# EAGLE design n7byu_k3ng_rotator_shield (EAGLE 6.6.0)
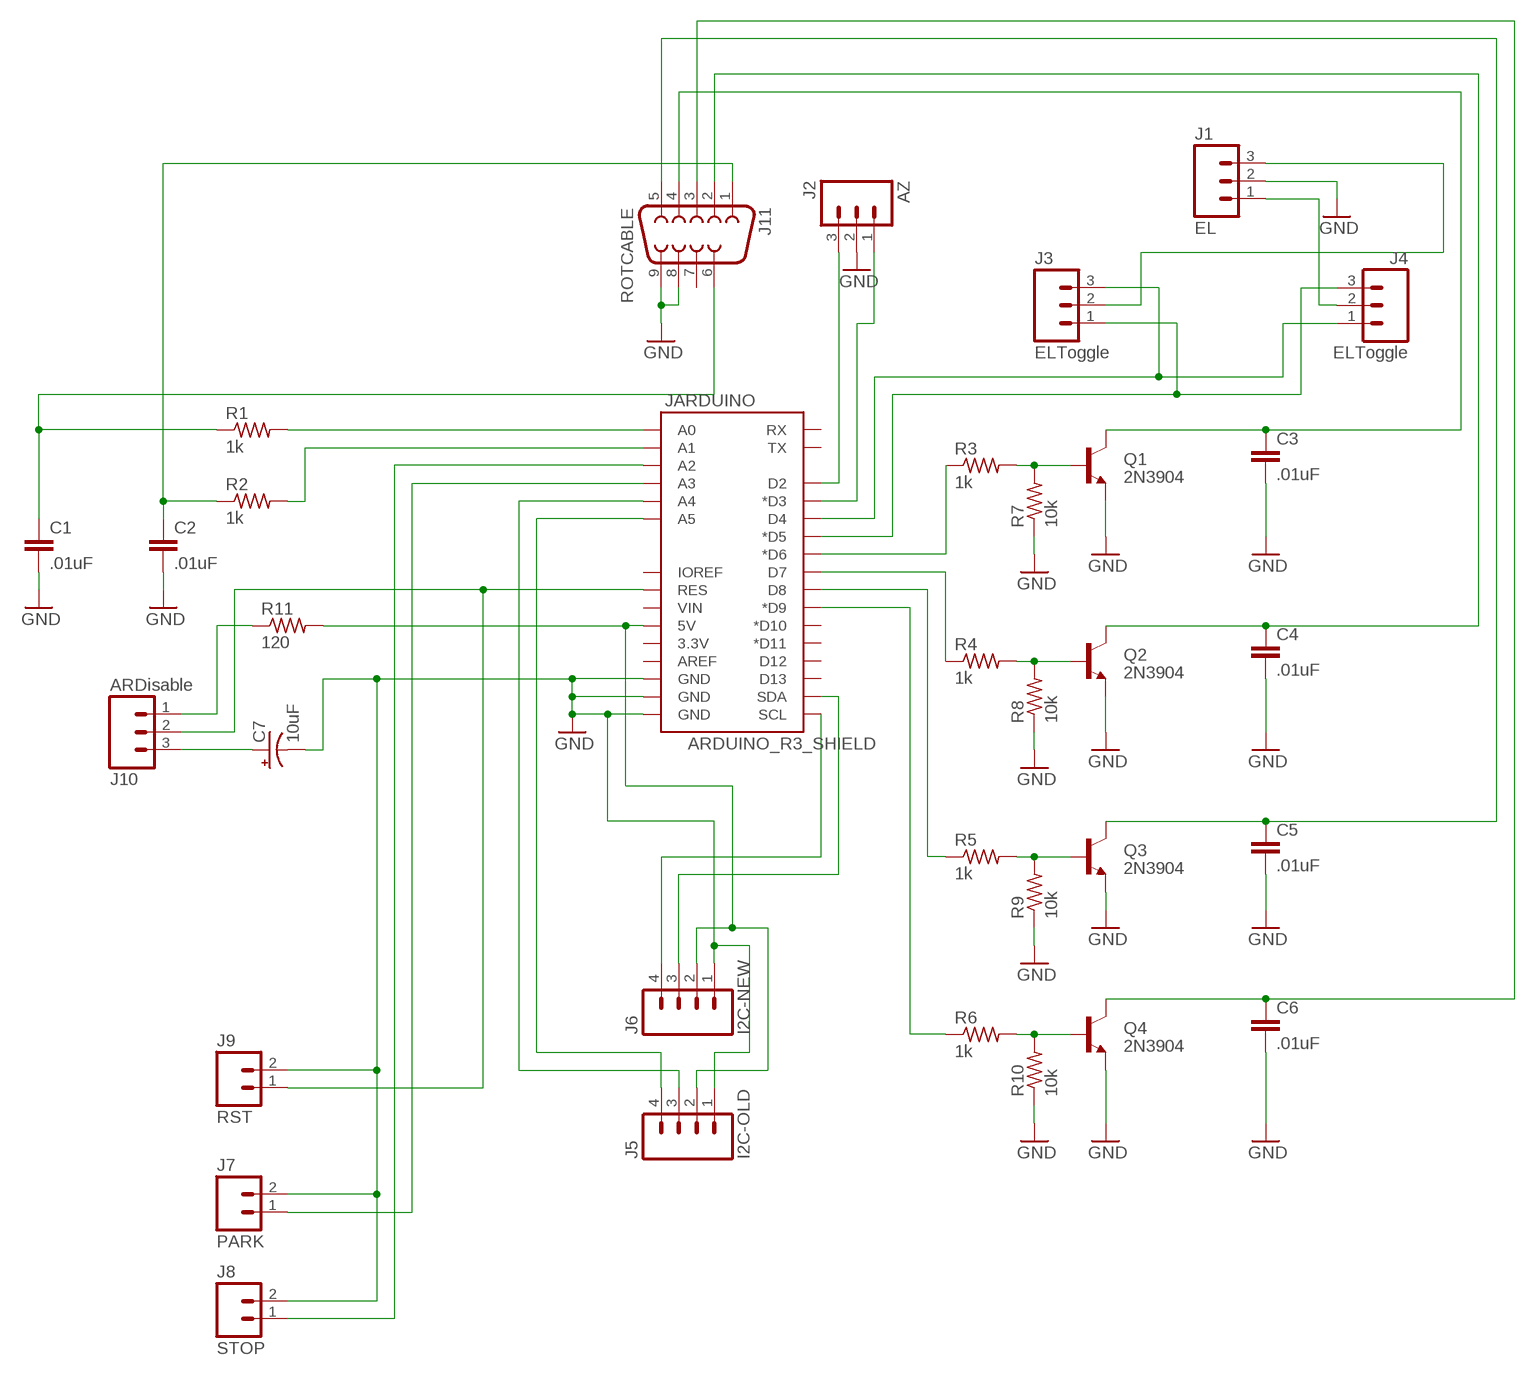
[diagram p0: schematic, sheet 1]

## Parts
C1  .01uF  CAPEZ  [CAP-PTH-SMALLEZ]
C2  .01uF  CAPEZ  [CAP-PTH-SMALLEZ]
C3  .01uF  CAPEZ  [CAP-PTH-SMALLEZ]
C4  .01uF  CAPEZ  [CAP-PTH-SMALLEZ]
C5  .01uF  CAPEZ  [CAP-PTH-SMALLEZ]
C6  .01uF  CAPEZ  [CAP-PTH-SMALLEZ]
C7  10uF  CAP_POLPTH1  [CPOL-RADIAL-100UF-25V]
J1  EL  M03LOCK_LONGPADS  [1X03_LOCK_LONGPADS]
J2  AZ  M03LOCK_LONGPADS  [1X03_LOCK_LONGPADS]
J3  ELToggle  M03LOCK_LONGPADS  [1X03_LOCK_LONGPADS]
J4  ELToggle  M03LOCK_LONGPADS  [1X03_LOCK_LONGPADS]
J5  I2C-OLD  M04LOCK_LONGPADS  [1X04_LOCK_LONGPADS]
J6  I2C-NEW  M04LOCK_LONGPADS  [1X04_LOCK_LONGPADS]
J7  PARK  M02LOCK_LONGPADS  [1X02_LOCK_LONGPADS]
J8  STOP  M02LOCK_LONGPADS  [1X02_LOCK_LONGPADS]
J9  RST  M02LOCK_LONGPADS  [1X02_LOCK_LONGPADS]
J10  ARDisable  M03LOCK_LONGPADS  [1X03_LOCK_LONGPADS]
J11  ROTCABLE  DB9FEMALE  [DB9]
JARDUINO  ARDUINO_R3_SHIELD  [UNO_R3_SHIELD]
Q1  2N3904  TRANSISTOR_NPN2N3904-EZ  [TO-92-EZ]
Q2  2N3904  TRANSISTOR_NPN2N3904-EZ  [TO-92-EZ]
Q3  2N3904  TRANSISTOR_NPN2N3904-EZ  [TO-92-EZ]
Q4  2N3904  TRANSISTOR_NPN2N3904-EZ  [TO-92-EZ]
R1  1k  R-US_0204/7  [0204/7]
R2  1k  R-US_0204/7  [0204/7]
R3  1k  R-US_0204/7  [0204/7]
R4  1k  R-US_0204/7  [0204/7]
R5  1k  R-US_0204/7  [0204/7]
R6  1k  R-US_0204/7  [0204/7]
R7  10k  R-US_0204/7  [0204/7]
R8  10k  R-US_0204/7  [0204/7]
R9  10k  R-US_0204/7  [0204/7]
R10  10k  R-US_0204/7  [0204/7]
R11  120  R-US_0204/7  [0204/7]

## Nets
CCW-BUTTON: J2.1 JARDUINO.D3(*D3)
CW-BUTTON: J2.3 JARDUINO.D2
GND: C1.2 C2.2 C3.2 C4.2 C5.2 C6.2 C7.2(-) J1.2 J2.2 J5.1 J6.1 J7.2 J8.2 J9.2 J11.8 J11.9 JARDUINO.GND@0(GND) JARDUINO.GND@1(GND) JARDUINO.GND@2(GND) Q1.1(E) Q2.1(E) Q3.1(E) Q4.1(E) R7.1 R8.1 R9.1 R10.1
N$1: C1.1 J11.6 R1.1
N$2: Q1.2(B) R3.2 R7.2
N$3: Q2.2(B) R4.2 R8.2
N$4: JARDUINO.A0 R1.2
N$5: C2.1 J11.1 R2.1
N$6: JARDUINO.A1 R2.2
N$7: Q3.2(B) R5.2 R9.2
N$8: Q4.2(B) R6.2 R10.2
N$9: C3.1 J11.4 Q1.3(C)
N$10: C4.1 J11.2 Q2.3(C)
N$11: C7.1(+) J10.3
N$12: C6.1 J11.3 Q4.3(C)
N$13: J9.1 J10.2 JARDUINO.RES
N$14: J1.1 J4.2
N$15: JARDUINO.D6(*D6) R3.1
N$16: JARDUINO.D7 R4.1
N$17: JARDUINO.D8 R5.1
N$18: C5.1 J11.5 Q3.3(C)
N$19: JARDUINO.D9(*D9) R6.1
N$20: J10.1 R11.1
N$21: J1.3 J3.2
N$22: J8.1 JARDUINO.A2
N$23: J3.3 J4.1 JARDUINO.D4
N$24: J3.1 J4.3 JARDUINO.D5(*D5)
N$25: J5.4 JARDUINO.A5
N$26: J5.2 J6.2 JARDUINO.5V R11.2
N$27: J5.3 JARDUINO.A4
N$28: J7.1 JARDUINO.A3
N$29: J6.3 JARDUINO.SDA
N$32: J6.4 JARDUINO.SCL
Unconnected: J11.7 JARDUINO.3.3V JARDUINO.AREF JARDUINO.D10(*D10) JARDUINO.D11(*D11) JARDUINO.D12 JARDUINO.D13 JARDUINO.IOREF JARDUINO.RX JARDUINO.TX JARDUINO.VIN

## Library data of the parts
C1-C6 = SparkFun-Capacitors:CAP: Capacitor Standard 0603 ceramic capacitor, and 0.1" leaded capacitor.
C7 = SparkFun-Capacitors:CAP_POL: Capacitor Polarized These are standard SMD and PTH capacitors. Normally 10uF, 47uF, and 100uF in electrolytic and tantalum varieties. Always verify the external diameter of the through hole cap, it varies with capacity, voltage, and manufacturer. The EIA devices should be standard.
J1-J4 J10 = SparkFun-Connectors:M03: Header 3 Standard 3-pin 0.1" header. Use with straight break away headers (SKU : PRT-00116), right angle break away headers (PRT-00553), swiss pins (PRT-00743), machine pins (PRT-00117), and female headers (PRT-00115). Molex polarized connector foot print use with SKU : PRT-08232 with associated crimp pins and housings.
J5 J6 = SparkFun-Connectors:M04: Header 4 Standard 4-pin 0.1" header. Use with straight break away headers (SKU : PRT-00116), right angle break away headers (PRT-00553), swiss pins (PRT-00743), machine pins (PRT-00117), and female headers (PRT-00115). Molex polarized connector foot print use with SKU : PRT-08231 with associated crimp pins and housings. 1MM SMD Version SKU: PRT-10208; PROD_ID: CONN-09696
J7-J9 = SparkFun-Connectors:M02: Standard 2-pin 0.1" header. Use with - straight break away headers ( PRT-00116) - right angle break away headers (PRT-00553) - swiss pins (PRT-00743) - machine pins (PRT-00117) - female headers (PRT-00115) Molex polarized connector foot print use with: PRT-08233 with associated crimp pins and housings. 2.54_SCREWTERM for use with PRT-10571. 3.5mm Screw Terminal footprints for PRT-08084 5mm Screw Terminal footprints for use with PRT-08432
J11 = SparkFun-Connectors:DB9: DB9 Connector Standard DB9 (D-Sub 9) serial connector. Can be used for CAN bus as well as RS485 and RS232. Footprint production proven. Spark Fun Electronics SKU : PRT-00429; PROD_ID: CONN-08194
JARDUINO = SparkFun-Boards:ARDUINO_R3_SHIELD: Shield form compatible with the Arduino Uno R3.
Q1-Q4 = SparkFun-DiscreteSemi:TRANSISTOR_NPN: Generic NPN BJT MMBT2222A - TRANS-08049 (SOT-23, 1A 40V) MPSA42 - TRANS-09116 (SOT-23, 500mA 300V) MMBT5088LT1G - TRANS-11160 (SOT-23, 50 mA 30V) BC547 - COM-08928 <http://www.sparkfun.com/products/8928> (TO-92 45V 100mA) (1.Collector 2.Base 3.Emitter) 2N3904 - COM-00521 <http://www.sparkfun.com/products/521> (TO-92 40V 200mA) (1.Emitter 2.Base 3.Collector) P2N2222A - COM-12852 <http://www.sparkfun.com/products/12852> (TO-92 40V 600mA) (1.Collector 2.Base 3.Emitter); PROD_ID: TRANS-08447
R1-R11 = resistor:R-US_: RESISTOR, American symbol

## Net classes
0 default: width 0.254 mm, clearance 0.254 mm

## Board
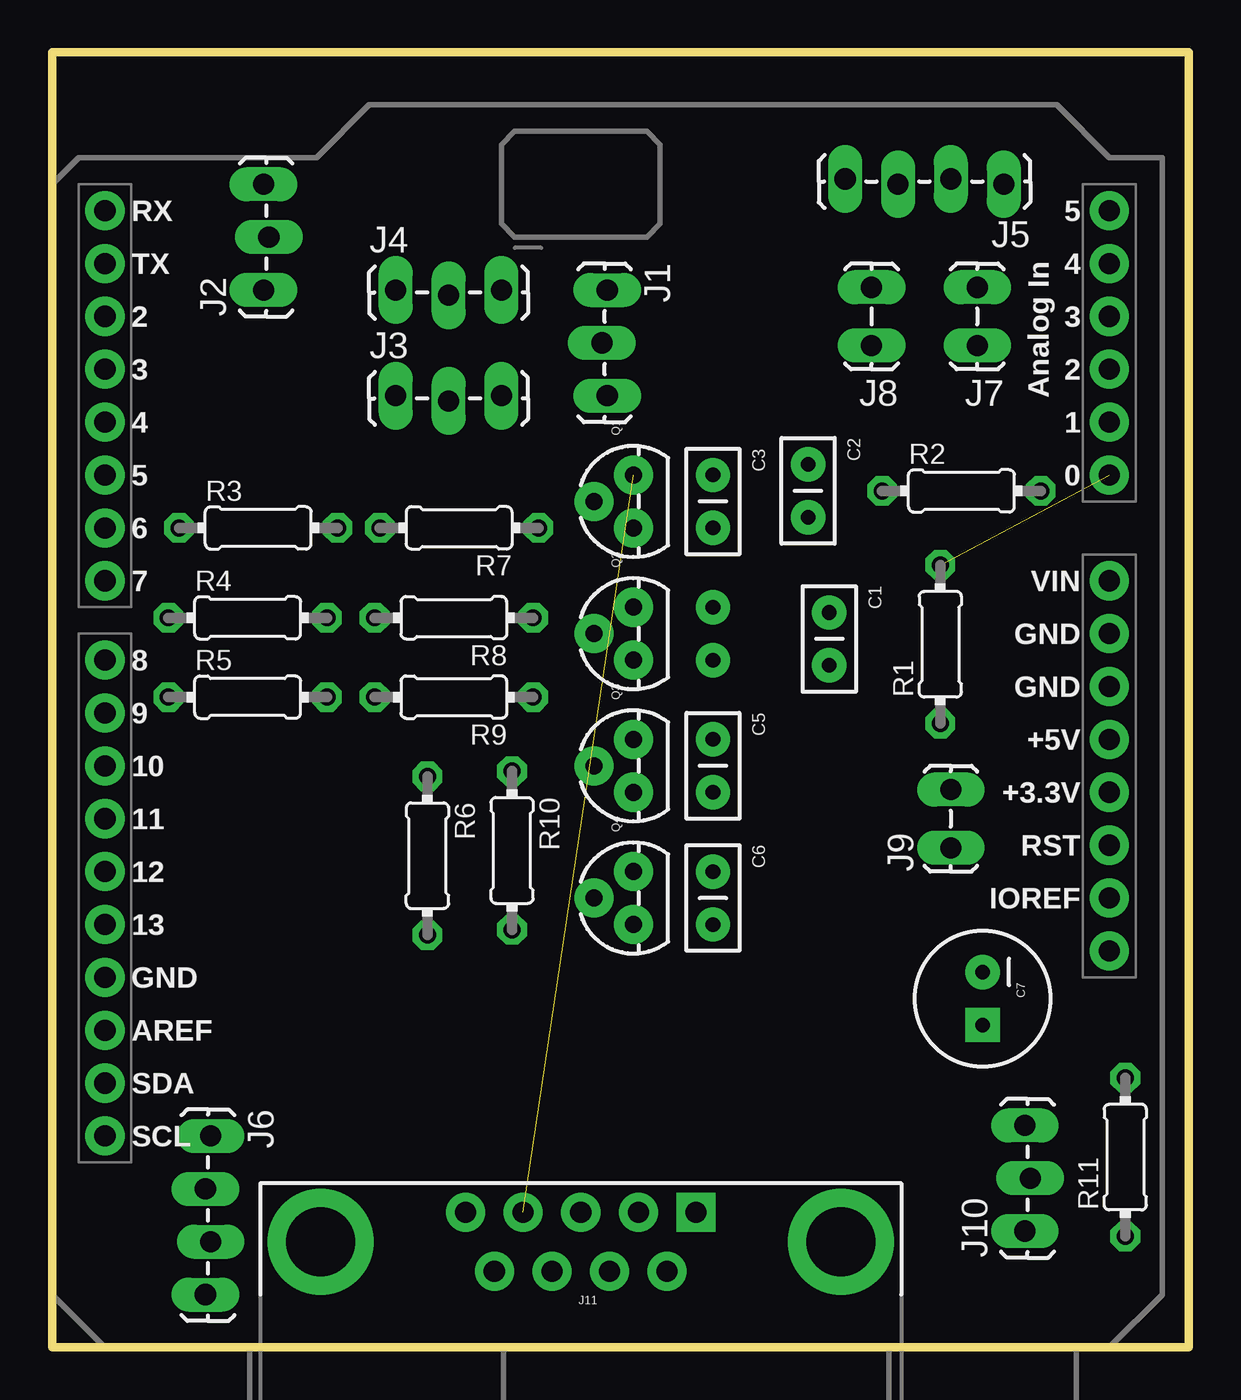
[diagram p1: board, top side]
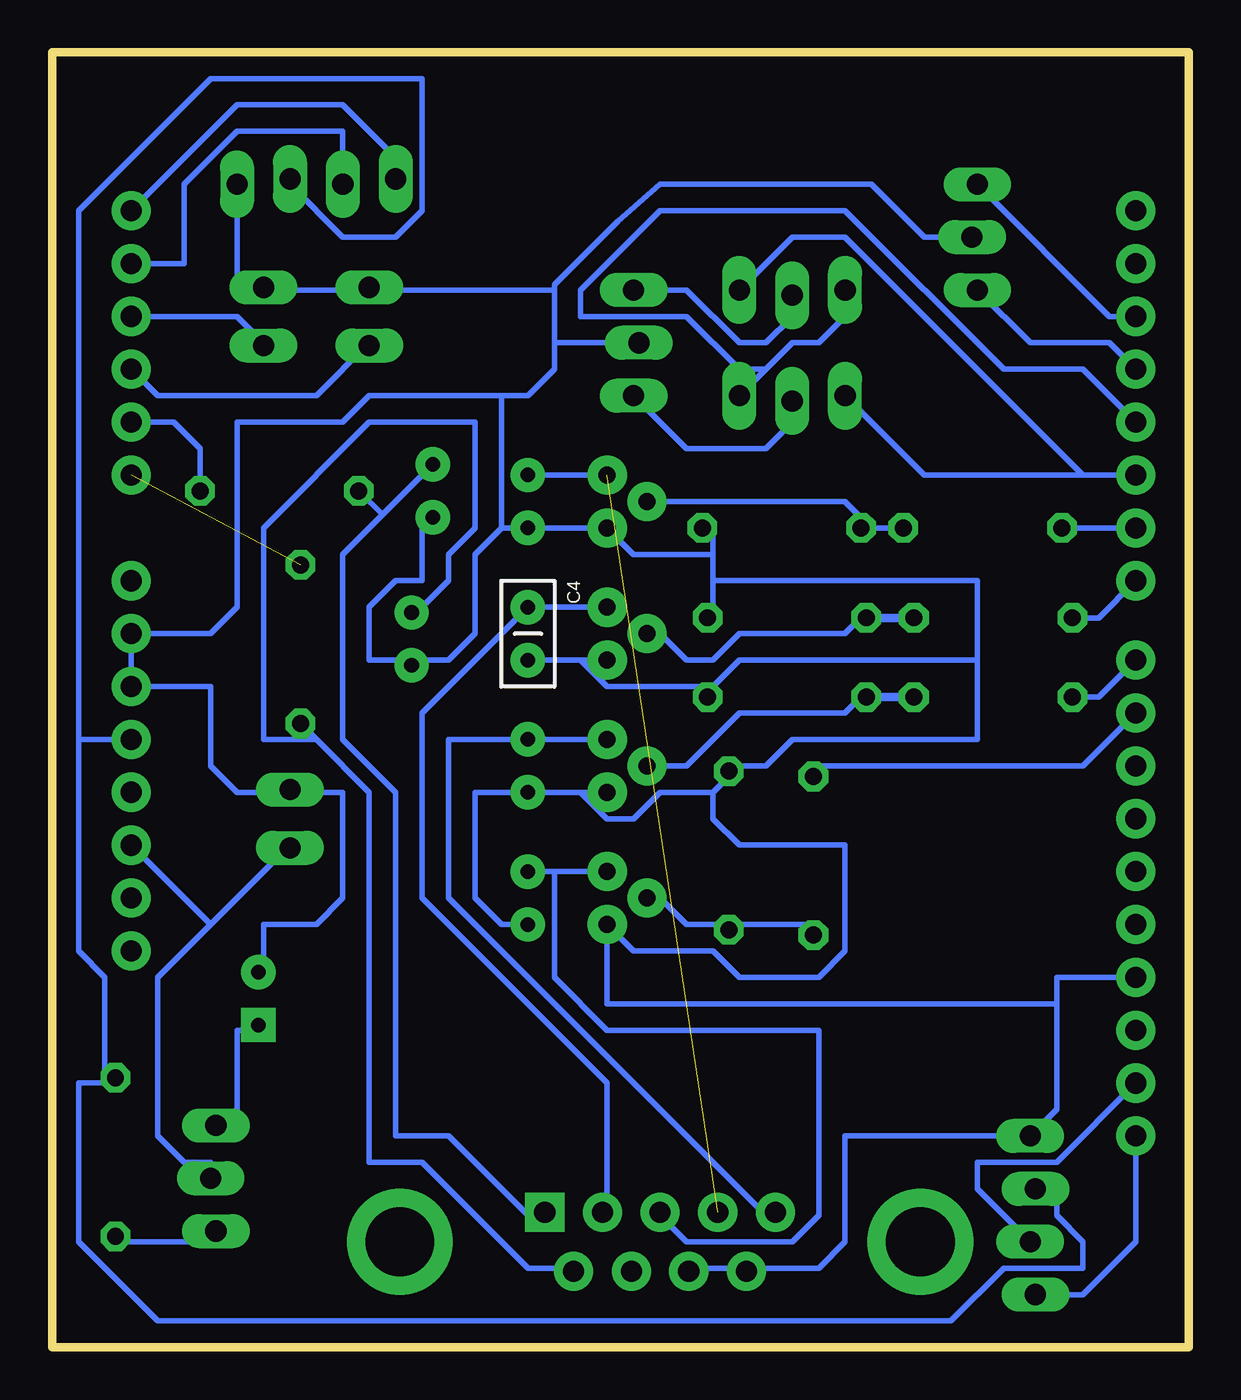
[diagram p2: board, bottom side, seen from below]

Size 54.61 x 62.23 mm. Coordinates in mm from the lower left corner, seen from the top.
Outline: 0,62.23 54.61,62.23 54.61,0 0,0 0,62.23
Copper layers (1*16): Top 0.035mm / dielectric 1.5mm / Bottom 0.035mm
Design rules "SparkFun": minimum track width 8mil, minimum drill 20mil, track to track 8mil, track to pad 8mil, pad to pad 8mil, via to via 8mil, smd to smd 8mil, copper to edge 10mil, drill to drill 8mil, minimum pad ring 12mil, minimum via ring 10mil, stop-mask expansion 4mil, vias tented up to drill 25mil, thermal gap 10mil

### Footprints (pad centres in the part's own frame; a part is rotated, then mirrored left to right if it is on the bottom)
CAP-PTH-SMALLEZ = drill 0.7 pad 1.651: 1 0,0; 2 2.54,0
CPOL-RADIAL-100UF-25V = drill 0.7 pad 1.651 square: 1 1.27,0 | drill 0.7 pad 1.651: 2 -1.27,0
1X03_LOCK_LONGPADS = drill 1.016 long: 1 0,0; 2 2.54,-0.254; 3 5.08,0
1X04_LOCK_LONGPADS = drill 1.016 long: 1 0,0; 2 2.54,-0.254; 3 5.08,0; 4 7.62,-0.254
1X02_LOCK_LONGPADS = drill 1.016 long: 1 -0.127,0; 2 2.667,0
DB9 = drill 1.016 pad 1.88 square: 1 -5.54,-1.42 | drill 1.016 pad 1.88: 2 -2.77,-1.42; 3 0,-1.42; 4 2.77,-1.42; 5 5.54,-1.42; 6 -4.15,1.42; 7 -1.38,1.42; 8 1.38,1.42; 9 4.15,1.42 | drill 3.302 pad 5.08: G1 -12.5,0; G2 12.5,0
UNO_R3_SHIELD = drill 1.016 pad 1.88: 3.3V 50.8,26.67; 5V 50.8,29.21; A0 50.8,41.91; A1 50.8,44.45; A2 50.8,46.99; A3 50.8,49.53; A4 50.8,52.07; A5 50.8,54.61; AREF 2.54,15.24; D2 2.54,49.53; D3 2.54,46.99; D4 2.54,44.45; D5 2.54,41.91; D6 2.54,39.37; D7 2.54,36.83; D8 2.54,33.02; D9 2.54,30.48; D10 2.54,27.94; D11 2.54,25.4; D12 2.54,22.86; D13 2.54,20.32; GND@0 50.8,31.75; GND@1 50.8,34.29; GND@2 2.54,17.78; IOREF 50.8,21.59; NC 50.8,19.05; RES 50.8,24.13; RX 2.54,54.61; SCL 2.54,10.16; SDA 2.54,12.7; TX 2.54,52.07; VIN 50.8,36.83
TO-92-EZ = drill 0.813 pad 1.88: 1 -1.27,0; 2 0,1.905; 3 1.27,0
0204/7 = drill 0.813 octagon: 1 -3.81,0; 2 3.81,0

### Placement (x,y rotation side)
C1  37.34,35.31 270 top
C2  36.32,42.42 270 top
C3  31.75,41.91 270 top
C4  31.75,35.56 270 bottom
C5  31.75,29.21 270 top
C6  31.75,22.86 270 top
C7  44.7,16.76 270 top
J1  26.67,50.8 270 top
J2  10.16,50.8 90 top
J3  16.51,45.72 0 top
J4  16.51,50.8 0 top
J5  45.72,55.88 180 top
J6  7.62,10.16 270 top
J7  44.45,48.26 90 top
J8  39.37,48.26 90 top
J9  43.18,24.13 90 top
J10  46.74,5.59 90 top
J11  25.4,5.08 180 top
JARDUINO  0,0 0 top
Q1  27.94,40.64 90 top
Q2  27.94,34.29 90 top
Q3  27.94,27.94 90 top
Q4  27.94,21.59 90 top
R1  42.67,33.78 90 top
R2  43.69,41.15 0 top
R3  9.91,39.37 0 top
R4  9.4,35.05 0 top
R5  9.4,31.24 0 top
R6  18.03,23.62 270 top
R7  19.56,39.37 180 top
R8  19.3,35.05 180 top
R9  19.3,31.24 180 top
R10  22.1,23.88 270 top
R11  51.56,9.14 90 top

### Tracks (layer width: path | path; a pad name or v marks a point on that pad's centre or on a via)
CCW-BUTTON
  Bottom 0.254: J2.1 7.62,48.26 3.81,48.26 JARDUINO.D3
CW-BUTTON
  Bottom 0.254: J2.3 3.81,49.53 JARDUINO.D2
GND
  Bottom 0.254: J11.8 24.13,3.81 21.59,3.81 J11.9 20.32,3.81 17.78,3.81 16.51,5.08 16.51,10.16 J6.1 6.35,11.43 6.35,16.51 | 6.35,16.51 6.35,17.78 JARDUINO.GND@2 | 6.35,16.51 27.94,16.51 Q4.1 26.67,19.05 22.86,19.05 21.59,17.78 17.78,17.78 16.51,19.05 16.51,24.13 21.59,24.13 22.86,25.4 22.86,26.67 | 22.86,26.67 21.59,27.94 | 22.86,26.67 25.4,26.67 26.67,25.4 27.94,25.4 29.21,26.67 | 29.21,26.67 C5.2 34.29,26.67 34.29,21.59 33.02,20.32 C6.2 | 29.21,26.67 Q3.1 | 22.86,31.75 27.94,31.75 29.21,33.02 | C4.2 29.21,33.02 | 29.21,33.02 Q2.1 | 22.86,38.1 22.86,39.37 R7.1 | 22.86,38.1 22.86,36.83 | 22.86,36.83 22.86,35.56 R8.1 | 33.02,39.37 34.29,38.1 34.29,34.29 35.56,33.02 36.83,33.02 C1.2 38.1,33.02 39.37,33.02 39.37,35.56 38.1,36.83 36.83,36.83 36.83,39.37 C2.2 | 33.02,39.37 C3.2 Q1.1 26.67,38.1 22.86,38.1 | 22.86,31.75 21.59,33.02 10.16,33.02 | 10.16,33.02 10.16,36.83 22.86,36.83 | 22.86,31.75 R9.1 | 21.59,27.94 20.32,27.94 19.05,29.21 10.16,29.21 10.16,33.02 | 21.59,27.94 R10.1 | 43.18,26.67 45.72,26.67 46.99,27.94 46.99,31.75 JARDUINO.GND@0 JARDUINO.GND@1 46.99,34.29 45.72,35.56 45.72,44.45 40.64,44.45 39.37,45.72 33.02,45.72 | 43.18,26.67 40.64,26.67 40.64,21.59 41.91,20.32 44.45,20.32 44.45,17.78 C7.2 | 43.18,26.67 J9.2 | 30.48,48.26 J1.2 | 30.48,50.8 30.48,48.26 | 39.37,50.8 30.48,50.8 | 39.37,50.8 44.45,50.8 | 39.37,50.8 J8.2 | J2.2 12.7,53.34 15.24,55.88 25.4,55.88 27.43,54.1 30.48,51.05 30.48,50.8 | J5.1 45.72,50.8 44.45,50.8 | 44.45,50.8 J7.2 | 33.02,45.72 31.75,45.72 30.48,46.99 30.48,48.26 | 33.02,45.72 33.02,39.37
N$1
  Bottom 0.254: 41.91,29.21 44.45,29.21 44.45,39.37 39.37,44.45 34.29,44.45 34.29,39.37 35.56,38.1 35.56,36.83 36.83,35.56 C1.1 | 41.91,29.21 39.37,26.67 39.37,8.89 36.83,8.89 31.75,3.81 30.48,3.81 J11.6 | 41.91,29.21 R1.1
N$2
  Bottom 0.254: 15.24,39.37 R3.2 | 15.24,39.37 16.51,40.64 Q1.2 | 15.24,39.37 R7.2
N$3
  Bottom 0.254: R8.2 15.24,35.56 16.51,34.29 21.59,34.29 22.86,33.02 24.13,33.02 25.4,34.29 Q2.2
  Bottom 0.406: R4.2 R8.2
N$4  (1 unrouted)
N$5
  Bottom 0.254: 38.73,40 40.64,38.1 40.64,29.21 38.1,26.67 38.1,10.16 35.56,10.16 31.75,6.35 J11.1 | 38.73,40 C2.1 | R2.1 38.73,40
N$6
  Bottom 0.254: R2.2 47.5,43.18 48.77,44.45 JARDUINO.A1
N$7
  Bottom 0.254: Q3.2 24.13,27.94 21.59,30.48 16.51,30.48 15.24,31.75 R9.2
  Bottom 0.406: R5.2 R9.2
N$8
  Bottom 0.254: 21.59,20.32 17.78,20.32 R6.2 | 21.59,20.32 24.13,20.32 25.4,21.59 Q4.2 | 21.59,20.32 R10.2
N$9  (1 unrouted)
  Bottom 0.254: Q1.3 C3.1
N$10
  Bottom 0.254: Q2.3 C4.1 36.83,30.48 36.83,21.59 27.94,12.7 27.94,6.35 J11.2
N$11
  Bottom 0.254: J10.3 45.72,11.43 45.72,15.24 44.45,15.24 C7.1
N$12
  Bottom 0.254: Q4.3 30.48,22.86 | 30.48,22.86 C6.1 | 30.48,22.86 30.48,17.78 27.94,15.24 17.78,15.24 17.78,6.35 19.05,5.08 24.13,5.08 25.4,6.35 J11.3
N$13
  Bottom 0.254: 46.99,20.32 43.18,24.13 J9.1 | 46.99,20.32 49.53,17.78 49.53,10.16 48.26,8.89 46.99,8.89 J10.2 | 46.99,20.32 JARDUINO.RES
N$14
  Bottom 0.254: J1.1 24.13,50.8 21.59,48.26 20.32,48.26 19.05,49.53 J4.2
N$15
  Bottom 0.254: JARDUINO.D6 R3.1 6.35,39.37
N$16
  Bottom 0.254: R4.1 4.32,35.05 JARDUINO.D7
N$17
  Bottom 0.254: R5.1 4.32,31.24 JARDUINO.D8
N$18
  Bottom 0.254: Q3.3 C5.1 35.56,29.21 35.56,21.59 20.32,6.35 J11.5
N$19
  Bottom 0.254: JARDUINO.D9 5.08,27.94 17.78,27.94 R6.1
N$20
  Bottom 0.254: R11.1 52.07,5.08 46.99,5.08 J10.1
N$21
  Bottom 0.254: J1.3 24.13,43.18 20.32,43.18 19.05,44.45 J3.2
N$22
  Bottom 0.254: JARDUINO.A2 49.53,45.72 41.91,45.72 39.37,48.26 J8.1
N$23
  Bottom 0.254: 20.32,46.99 19.05,48.26 17.78,48.26 16.51,49.53 J4.1 | 20.32,46.99 J3.3 | JARDUINO.D4 5.08,46.99 8.89,46.99 16.51,54.61 25.4,54.61 29.21,50.8 29.21,49.53 24.13,49.53 21.59,46.99 20.32,46.99
N$24
  Bottom 0.254: J3.1 12.7,41.91 5.08,41.91 | JARDUINO.D5 5.08,41.91 | J4.3 19.05,53.34 16.51,53.34 5.08,41.91
N$25
  Bottom 0.254: JARDUINO.A5 45.72,59.69 40.64,59.69 38.1,57.15 J5.4
N$26
  Bottom 0.254: 52.07,12.7 52.07,17.78 53.34,19.05 53.34,29.21 | JARDUINO.5V 53.34,29.21 | 52.07,12.7 53.34,12.7 53.34,5.08 49.53,1.27 11.43,1.27 8.89,3.81 5.08,3.81 5.08,5.08 6.35,6.35 6.35,7.62 J6.2 | 52.07,12.7 R11.2 | 53.34,29.21 53.34,54.61 46.99,60.96 36.83,60.96 36.83,54.61 38.1,53.34 40.64,53.34 43.18,55.88 J5.2
N$27
  Bottom 0.254: J5.3 40.64,58.42 45.72,58.42 48.26,55.88 48.26,52.07 JARDUINO.A4
N$28
  Bottom 0.254: JARDUINO.A3 45.72,49.53 44.45,48.26 J7.1
N$29
  Bottom 0.254: J6.3 10.16,7.62 10.16,8.89 6.35,8.89 JARDUINO.SDA
N$32
  Bottom 0.254: J6.4 5.08,2.54 2.54,5.08 JARDUINO.SCL